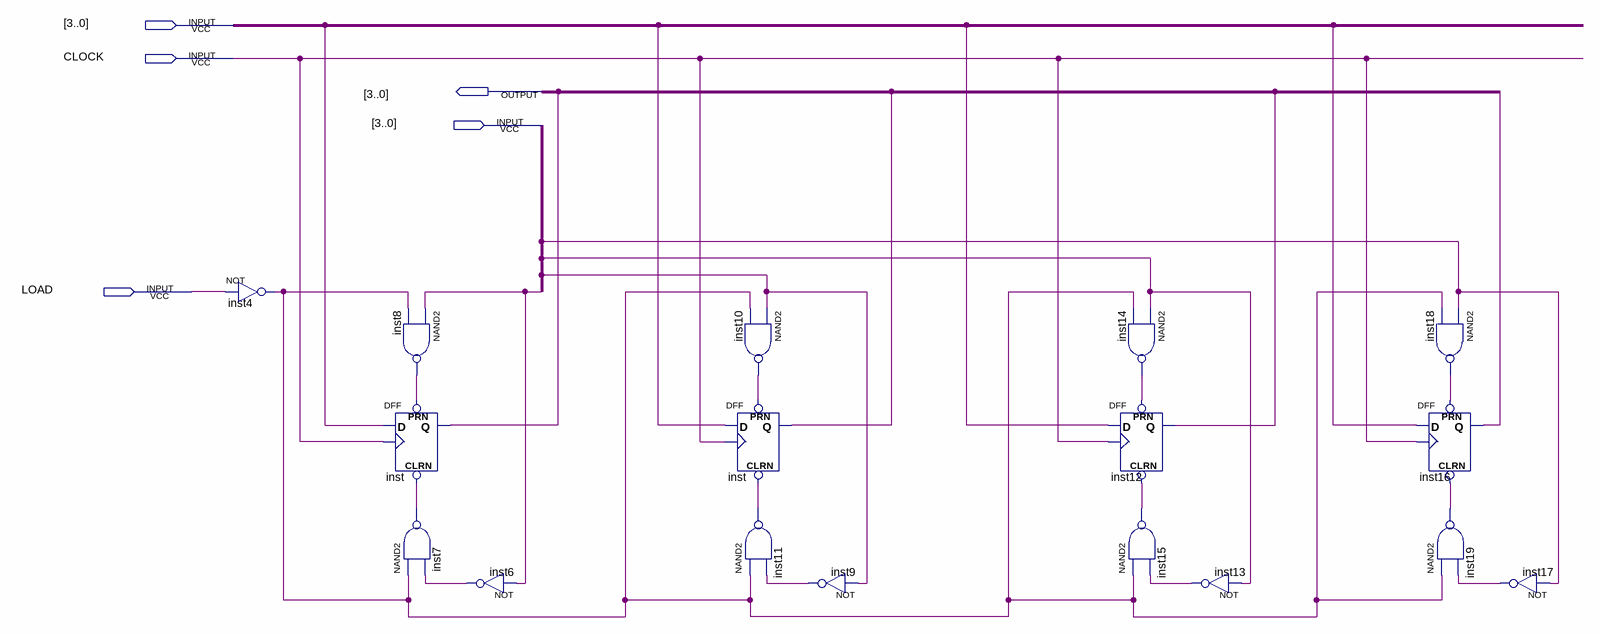
[diagram p0: schematic sheet]
// Quartus schematic PARALLEL.bdf as structural Verilog: 17 symbols, 5 pins
module PARALLEL (
  input  CLOCK,
  input  LOAD
);

  wire inst4_out, inst6_out, inst7_out, inst8_out, inst9_out, inst10_out, inst11_out, inst13_out, inst14_out,
       inst15_out, inst17_out, inst18_out, inst19_out, inst_q, undriven, undriven_2;

  not inst4 (inst4_out, LOAD);
  DFF inst (.CLRN(inst7_out), .CLK(CLOCK), .D(undriven_2), .PRN(inst8_out), .Q(inst_q));
  nand inst8 (inst8_out, undriven, inst4_out);
  nand inst7 (inst7_out, inst4_out, inst6_out);
  not inst6 (inst6_out, undriven);
  nand inst10 (inst10_out, undriven, inst4_out);
  DFF inst_dup2 (.CLRN(inst11_out), .CLK(CLOCK), .D(undriven_2), .PRN(inst10_out), .Q(inst_q));
  nand inst11 (inst11_out, inst4_out, inst9_out);
  not inst9 (inst9_out, undriven);
  nand inst14 (inst14_out, undriven, inst4_out);
  DFF inst12 (.CLRN(inst15_out), .CLK(CLOCK), .D(undriven_2), .PRN(inst14_out), .Q(inst_q));
  nand inst15 (inst15_out, inst4_out, inst13_out);
  not inst13 (inst13_out, undriven);
  nand inst18 (inst18_out, undriven, inst4_out);
  DFF inst16 (.CLRN(inst19_out), .CLK(CLOCK), .D(undriven_2), .PRN(inst18_out), .Q(inst_q));
  nand inst19 (inst19_out, inst4_out, inst17_out);
  not inst17 (inst17_out, undriven);
endmodule
